# Altium schematic sheet Sheet.SchDoc
size A4; SheetNumber: 1; SheetTotal: 1
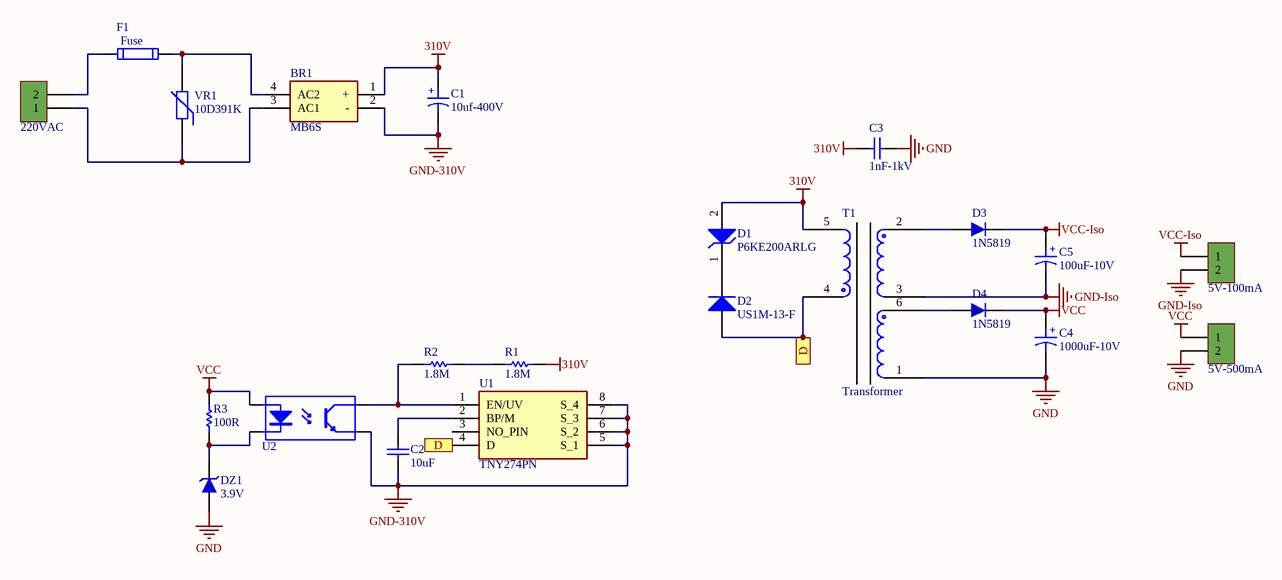
[diagram p0: Sheet.SchDoc]

## Parts
5V-100mA  Phoenix 2 Pin  [Phoenix_2PIN_RA_P5.08mm]  (value not drawn)
5V-500mA  Phoenix 2 Pin  [Phoenix_2PIN_RA_P5.08mm]  (value not drawn)
220VAC  Phoenix 2 Pin  [Phoenix_2PIN_RA_P5.08mm]  (value not drawn)
BR1  MB6S  [SOP250P700X270-4N]
C1  10uf-400V  [Cap electrolitic radial 10x16-5]
C2  10uF  [CAP805]
C3  1nF-1kV  [CAP1206]
C4  1000uF-10V  [Cap electrolitic radial 8x12-3.5]
C5  100uF-10V  [Cap electrolitic radial 5x11-2]
D1  P6KE200ARLG  [ONSC-SURMETIC40-2-017AA-01]
D2  US1M-13-F  [DIOD-SMA-2_A_V]
D3  1N5819  [430X270D]
D4  1N5819  [430X270D]
DZ1  3.9V  [SOD80, LL-34]
F1  FUSE_HOLDER_METAL  [FUSE_5X20MM_4PIN]  (value not drawn)
R1  1.8M  [RES0603_(1608X06L)]
R2  1.8M  [RES0603_(1608X06L)]
R3  100R  [RES0603_(1608X06L)]
T1  Transformer  [EE16]
U1  TNY274PN  [DIP762W56P254L958H406Q8N]
U2  PC817  [SOP4]  (value not drawn)
VR1  10D391K  [10D XXX]

## Ports
D (see Sheet[2C]), D (see Sheet[3C])

## Nets
310V: BR1.1(+) C1.1 C3.2 D1.2(A) R1.2 T1.5
GND: 5V-500mA.2 C3.1 C4.2 DZ1.1 T1.1
GND-310V: BR1.2(-) C1.2 C2.1 U1.5(S_1) U1.6(S_2) U1.7(S_3) U1.8(S_4) U2.3(E)
GND-Iso: 5V-100mA.2 C5.2 T1.3
VCC: 5V-500mA.1 C4.1 D4.2 R3.2 U2.1(A)
VCC-Iso: 5V-100mA.1 C5.1 D3.2
D: D2.1(A) T1.4 U1.4(D) ; port D
Net220VAC_1: 220VAC.1 BR1.3(AC1) VR1.1
Net220VAC_2: 220VAC.2 F1.1
NetBR1_4: BR1.4(AC2) F1.2 VR1.2
NetC2_2: C2.2 U1.2(BP/M)
NetD1_1: D1.1(K) D2.2(K)
NetD3_1: D3.1 T1.2
NetD4_1: D4.1 T1.6
NetDZ1_2: DZ1.2 R3.1 U2.2(K)
NetR1_1: R1.1 R2.2
NetR2_1: R2.1 U1.1(EN/UV) U2.4(C)

Not connected (* = marked no-connect by the designer): U1 3(NO_PIN)

## Notes on the sheet
- (in symbol Cap ELECTROLITIC TOTAL SIZE) +
- (in symbol FUSE METAL 4PIN) Fuse

## Library data of the parts
BR1 = MB6S: Bridge Rectifier; Manufacturer_Name: HY Electronic Corp; Datasheet Link: http://docs-emea.rs-online.com/webdocs/14bb/0900766b814bbf67.pdf; Height: 2.7mm; Manufacturer_Part_Number: MB6S
C1 = Cap ELECTROLITIC TOTAL SIZE: Cap electrolitic radial; Designer: Abbas Basereh; VALUE: 10uF; Data: 16-12-2016; Part. No: *
C2 C3 = CAP SMD PACKAGE: TOTAL CAPACITOR SMD PACK; Designer: Abbas Basereh; Desc.: CAP SMD TOTAL PACKAGES; VALUE: 100nF; Data: 2017-3-10
C4 C5 = Cap ELECTROLITIC TOTAL SIZE: Cap electrolitic radial; Designer: Abbas Basereh; VALUE: 1uF; Data: 16-12-2016; Part. No: *
D1 = CMP-1061-00679-1: 600 W Peak Power Transient Voltage Suppressor, 2-Pin Surmetic(TM) 40, Pb-Free, Tape and Reel; Manufacturer: On Semiconductor; Direction: Unidirectional; PPK Max (W): 600; IR Max (uA): 5; V(BR) Typ (V): 200; RoHS: Pb-Free; ComponentLink3URL: http://www.onsemi.cn/pub_link/Collateral/017AA.PDF; PartNumber: P6KE200ARLG; ComponentLink2Description: Datasheet; PackageReference: SURMETIC40-2-017AA-01; ComponentLink3Description: Package Specification; Packing: Tape and Reel; PackageDescription: 2-Pin, Axial Lead, Diameter 3.49 mm; ComponentLink1Description: Manufacturer URL; PackageVersion: Rev. O, 09/2005; Mounting Technology: Through Hole; DatasheetVersion: Rev. 10; ComponentLink2URL: http://www.onsemi.com/pub_link/Collateral/P6KE6.8A-D.PDF; ComponentLink1URL: http://www.onsemi.com/
D2 = CMP-2000-07364-1: Ultra-Fast Rectifier, 1 A, 1.7 V, -65 to 150 degC, 2-Pin SMA, RoHS, Tape and Reel; Manufacturer: Diodes Inc; Forward Voltage: 1.7V; Reverse Recovery Time-Max: 75ns; Average Rectified Current-Max: 1A; Reverse Current-Max: 5µA; Reverse Voltage-Max [Vrrm]: 1000V; Package Description: 2-Pin Surface Mount Device, Body 4.3 x 2.605 mm; Datasheet URL: http://www.diodes.com/_files/datasheets/ds16008.pdf; Datasheet Version: Rev. 11-2, 12/2014; Package Reference: SMA-2; Mounting Technology: SurfaceMount; Manufacturer URL: http://www.diodes.com/
D3 D4 = 1N5819: Schottkey Rectifiers; Designer: Abbas Basereh; Data: 16-12-2016; Link: *; Part. No: *
DZ1 = ZENER GENERAL DIODE: DIODE ZENER GENERAL; VALUE: 12V; Published: 2017-1-12; PackageVersion: 2017-1-12; PackageReference: DO 35; Publisher: Abbas Basereh; PackageDescription: DIODE GEN ZENER; ComponentLink1Description: Manufacturer Link; ComponentLink2Description: Datasheet
F1 = FUSE METAL 4PIN
R1-R3 = RES SMD PACKAGE: TOTAL SMD RESISTOR PACK; Designer: Abbas Basereh; Desc.: RES SMD PAKAGES; Data: 2017-3-10
T1 = EE16
U1 = TNY274PN: Integrated Circuit; Manufacturer_Name: Power Integrations; Datasheet Link: https://datasheet.datasheetarchive.com/originals/distributors/Datasheets-28/DSA-551610.pdf; Height: 4.06mm; Manufacturer_Part_Number: TNY274PN; Mouser Part Number: 869-TNY274PN; Mouser Price/Stock: https://www.mouser.co.uk/ProductDetail/Power-Integrations/TNY274PN?qs=%252Bk6%2F5FB6qrkuAGauUJhMww%3D%3D
U2 = PC817: General Purpose Photocoupler
VR1 = VARISTOR (VDR): VARISTORS; Manufacturer: china-canada-philipina; Designer: Abbas Basereh; VALUE: xxDxxx; Models: MOV-VDR-COV; Data: 2017-1-5; Link: digikey.com; PUBLISHER: ABBAS BASEREH